# EAGLE schematic schaltplan_rsu-2 (EAGLE 7.7.0)
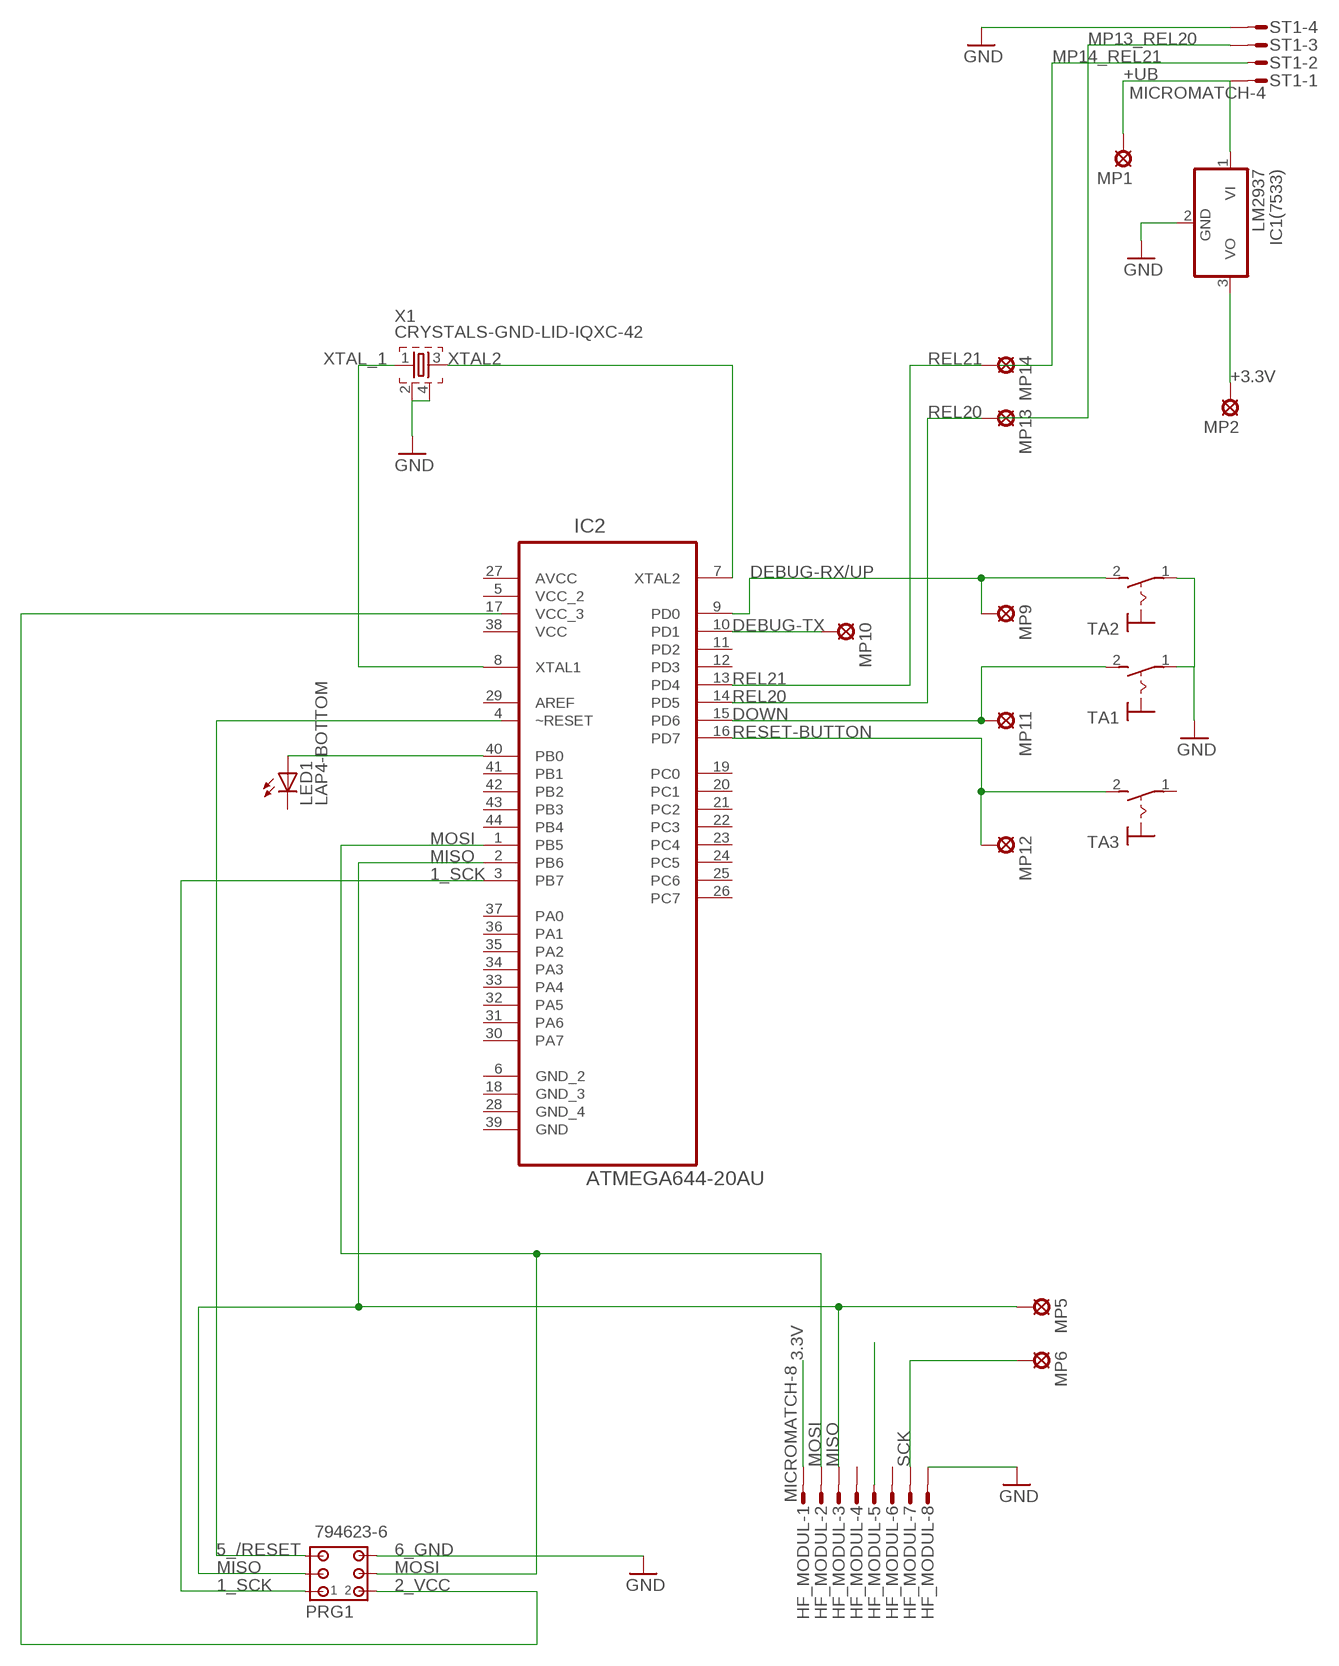
[diagram p0: schematic, sheet 1]

## Parts
HF_MODUL  MICROMATCH-8  [MICROMATCH-8]
IC1(7533)  LM2937  [TO263-3]
IC2  ATMEGA644-20AU  [QFP80P1200X1200X120-44N]
LED1  LAP4-BOTTOM  [P47F-BOTTOM]
MP1  LSP11  [LSP11]
MP2  LSP11  [LSP11]
MP5  LSP11  [LSP11]
MP6  LSP11  [LSP11]
MP9  LSP11  [LSP11]
MP10  LSP11  [LSP11]
MP11  LSP11  [LSP11]
MP12  LSP11  [LSP11]
MP13  LSP11  [LSP11]
MP14  LSP11  [LSP11]
PRG1  794623-6  [794623-6]
ST1  MICROMATCH-4  [MICROMATCH-4]
TA1  MS243  [MS243]
TA2  MS243  [MS243]
TA3  MS243  [MS243]
X1  CRYSTALS-GND-LID-IQXC-42  [2.0X1.6-4-PAD]

## Nets
1_SCK: IC2.3(PB7) PRG1.1
2_VCC: PRG1.2
3.3V: HF_MODUL.1
5_/RESET: PRG1.5
6_GND: HF_MODUL.8 IC1(7533).2(GND) PRG1.6 ST1.4 TA1.1(P) TA2.1(P) X1.2 X1.4 ; supply symbol labelled GND
+3.3V: IC1(7533).3(VO) MP2.MP
+UB: IC1(7533).1(VI) MP1.MP ST1.1
DEBUG-RX/UP: IC2.9(PD0) MP9.MP TA2.2(S)
DEBUG-TX: IC2.10(PD1) MP10.MP
DOWN: IC2.15(PD6) MP11.MP TA1.2(S)
MISO: HF_MODUL.3 IC2.2(PB6) MP5.MP PRG1.3
MOSI: HF_MODUL.2 IC2.1(PB5) PRG1.4
MP13_REL20: ST1.3
N$1: IC2.40(PB0) LED1.A
REL20: IC2.14(PD5) MP13.MP
REL21: IC2.13(PD4) MP14.MP
RESET-BUTTON: IC2.16(PD7) MP12.MP TA3.2(S)
SCK: HF_MODUL.7 MP6.MP
XTAL2: IC2.7(XTAL2) X1.3
XTAL_1: IC2.8(XTAL1) X1.1
Unconnected: HF_MODUL.4 HF_MODUL.5 HF_MODUL.6 IC2.4(~RESET) IC2.6(GND_2) IC2.11(PD2) IC2.12(PD3) IC2.18(GND_3) IC2.19(PC0) IC2.20(PC1) IC2.21(PC2) IC2.22(PC3) IC2.23(PC4) IC2.24(PC5) IC2.25(PC6) IC2.26(PC7) IC2.28(GND_4) IC2.29(AREF) IC2.30(PA7) IC2.31(PA6) IC2.32(PA5) IC2.33(PA4) IC2.34(PA3) IC2.35(PA2) IC2.36(PA1) IC2.37(PA0) IC2.39(GND) IC2.41(PB1) IC2.42(PB2) IC2.43(PB3) IC2.44(PB4) LED1.C ST1.2 TA3.1(P)

## Power pins joined to a net without a drawn wire
AVCC: IC2.27(AVCC)
VCC: IC2.38(VCC)
VCC_2: IC2.5(VCC_2)
VCC_3: IC2.17(VCC_3)

## Library data of the parts
HF_MODUL = con-amp-micromatch:MICROMATCH-8: MicroMaTch 8 7-215464-8 / 0-215464-8 Drawing Number C-215464 DDEController.pdf; MF: FARNELL; MPN: 7-215464-8; OC_FARNELL: 3784642; OC_NEWARK: 26H0301
IC1(7533) = linear:LM2937: LM2937-2.5, LM2937-3.3 400mA and 500mA Voltage Regulators Source: http://cache.national.com/ds/LM/LM2937-2.5.pdf
IC2 = Atmel_By_element14_Batch_1-00:ATMEGA644-20AU: Programmable Flash; MPN: ATMEGA644-20AU; OC_FARNELL: 1288339; OC_NEWARK: 23M5059; PACKAGE: TQFP-44; SUPPLIER: Atmel
LED1 = led:*P4: PointLED® Enhanced Thinfilm LED TOP & BOTTOM mount LS P47F, LR P47F, LA P47F, LY P47F, LT P4SG, LB P4SG, LW P4SG Source: http://catalog.osram-os.com .. LA_LR_LS_LY_P47F_Pb_free.pdf
MP1 MP2 MP5 MP6 MP9-MP14 = solpad:LSP11: SOLDER PAD drill 1.1 mm
PRG1 = con-amp:794623-6: MICRO MATE N LOK Dual Row, grid 1.5 mm Source: http://catalog.tycoelectronics.com .. ENG_CD_794623_F.pdf
ST1 = con-amp-micromatch:MICROMATCH-4: MicroMaTch 4 7-215464-4 / 0-215464-4 Drawing Number C-215464 DDEController.pdf; MPN: 7-215464-4; OC_FARNELL: 3784629; OC_NEWARK: 19R8124
TA1-TA3 = switch:MS243: TOGGLE SWITCH
X1 = IQD-Frequency-Products:CRYSTALS-GND-LID: CRYSTALS WITH CAN GROUNDED